# Altium schematic sheet rs485.SchDoc: Test
size A4; DrawnBy: Łukasz Przeniosło; Organization: Zachodniopomorski; Address1: Uniwersytet Technologiczny; Address2: w Szczecinie; Address3: Wydział Elektryczny; DocumentNumber: 6; Revision: 1.0; SheetNumber: 6; SheetTotal: 8
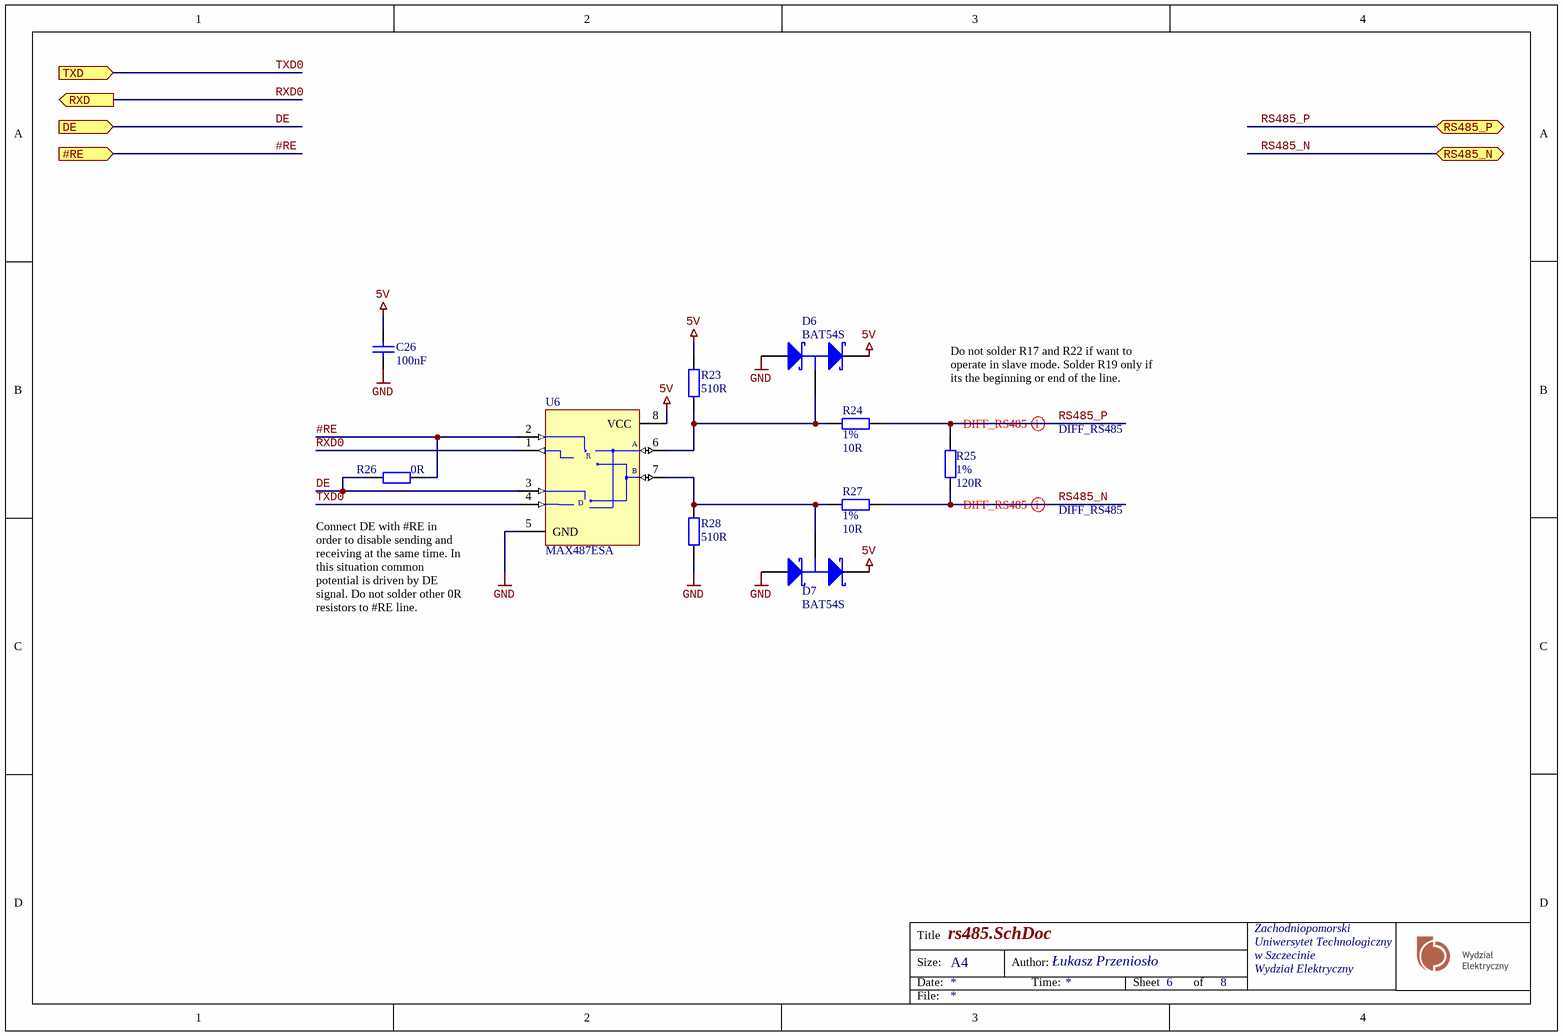
[diagram p0: rs485.SchDoc]

## Parts
C26  100nF  [CAPC1608N]
D6  BAT54S  [SOT23-3L]
D7  BAT54S  [SOT23-3L]
R23  510R  [RESC1608N]
R24  Tolerance: 1%  [RESC2012N]  (hidden comment: 10R)
R25  Tolerance: 1%  [RESC3216N]  (hidden comment: 120R)
R26  0R  [RESC1005N]
R27  Tolerance: 1%  [RESC2012N]  (hidden comment: 10R)
R28  510R  [RESC1608N]
U6  MAX487ESA  [SO-8_L]

## Ports
#RE (in), DE (in), RS485_N (bidir), RS485_P (bidir), RXD (out), TXD (in)

## Nets
5V: C26.1 D6.2(K) D7.2(K) R23.2 U6.8(VCC)
GND: C26.2 D6.1(A) D7.1(A) R28.1 U6.5(GND)
#RE: R26.2 U6.2(~{RE}) ; port #RE
DE: R26.1 U6.3(DE) ; port DE
RS485_N: R25.2 R27.1 ; port RS485_N
RS485_P: R24.1 R25.1 ; port RS485_P
RXD0: U6.1(RO) ; port RXD
TXD0: U6.4(DI) ; port TXD
NetD6_3: D6.3(C) R23.1 R24.2 U6.6(A)
NetD7_3: D7.3(C) R27.2 R28.2 U6.7(B)

## Layout directives
differential pair; net class DIFF_RS485: RS485_N, RS485_P

## Notes on the sheet
- Do not solder R17 and R22 if want to operate in slave mode. Solder R19 only if its the beginning or end of the line.
- (near R26) Connect DE with #RE in order to disable sending and receiving at the same time. In this situation common potential is driven by DE signal. Do not solder other 0R resistors to #RE line.
- Title
- Size:
- Date:
- A4
- Author:
- Time:
- Sheet
- of
- File:
- (in symbol MAX487ESA) R; D

## Library data of the parts
C26 = Capacitor: Value: 100nF
D6 D7 = BAT54S: Schottky Barrier Double Diode; Published: 17-Sep-2003; DatasheetVersion: 4-Mar-2002; PackageVersion: May-1999; PackageReference: SOT23; Publisher: Altium Limited; PackageDescription: 3-Pin SOT-23 Package 0.95 mm Pitch, 2.3 mm Lead Span; ComponentLink1Description: Manufacturer Link; ComponentLink1URL: http://www.semiconductors.philips.com/; ComponentLink2Description: Datasheet; ComponentLink2URL: http://www.semiconductors.philips.com/acrobat/datasheets/BAT54_SERIES_4.pdf; LatestRevisionDate: 12-Dec-2006; LatestRevisionNote: IPC-7351 Footprint Added.
R23 R28 = Resistor: Tolerance: 5%; Power: 0W; Value: 510R
R24 R25 R27 = Resistor: Power: 0W
  R24 R27: Value: 10R
  R25: Value: 120R
R26 = Resistor: Power: 0W; Tolerance: 1%; Value: 0R
U6 = MAX487ESA: Low-Power, Slew-Rate-Limited RS-485/RS-422 Transceiver; Published: 16-Jan-2001; LatestRevisionDate: 13-Apr-2006; LatestRevisionNote: IPC-7351 Footprint Added.; DatasheetVersion: Feb-1996; PackageReference: NSO8; Publisher: Altium Limited; PackageDescription: 8-Pin Small Outline Integrated Circuit 1.27 mm Pitch; Code_JEDEC: MS-012-AA; Code_IPC: SOIC127P600-8; ComponentLink1Description: Manufacturer Link; ComponentLink1URL: http://www.maxim-ic.com/; ComponentLink2Description: Datasheet; ComponentLink2URL: http://pdfserv.maxim-ic.com/en/ds/MAX1487-MAX491.pdf